# EAGLE design knife1 (EAGLE 7.7.0)
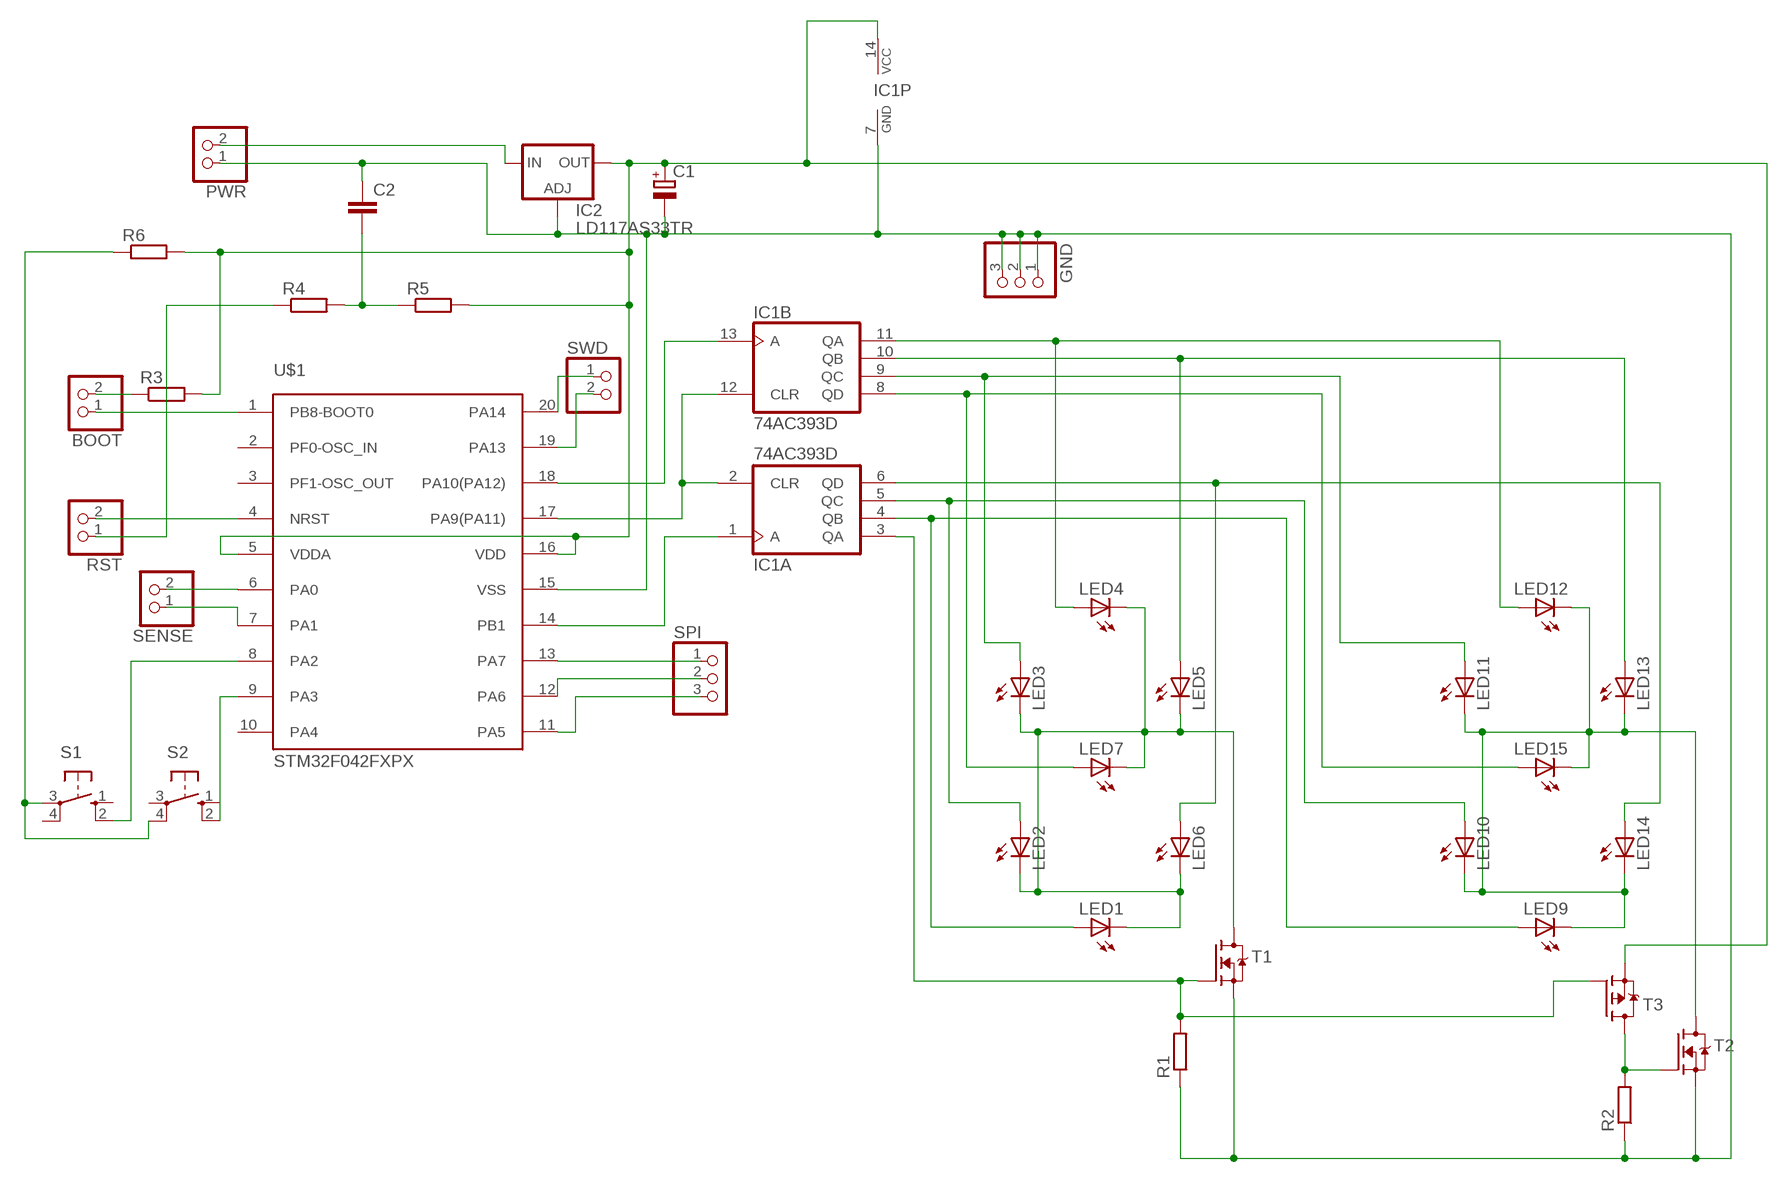
[diagram p0: schematic, sheet 1]

## Parts
BOOT  PINHD-1X2  [1X02]
C1  CPOL-EUSMCD  [SMC_D]
C2  C-EUC1206  [C1206]
GND  PINHD-1X3  [1X03]
IC1  74AC393D  [SO14]
IC2  LD117AS33TR  [SOT223]
LED1  LEDSQR2X5  [LED2X5]
LED2  LEDSQR2X5  [LED2X5]
LED3  LEDSQR2X5  [LED2X5]
LED4  LEDSQR2X5  [LED2X5]
LED5  LEDSQR2X5  [LED2X5]
LED6  LEDSQR2X5  [LED2X5]
LED7  LEDSQR2X5  [LED2X5]
LED9  LEDSQR2X5  [LED2X5]
LED10  LEDSQR2X5  [LED2X5]
LED11  LEDSQR2X5  [LED2X5]
LED12  LEDSQR2X5  [LED2X5]
LED13  LEDSQR2X5  [LED2X5]
LED14  LEDSQR2X5  [LED2X5]
LED15  LEDSQR2X5  [LED2X5]
PWR  PINHD-1X2  [1X02]
R1  R-EU_M1206  [M1206]
R2  R-EU_M1206  [M1206]
R3  R-EU_M1206  [M1206]
R4  R-EU_M1206  [M1206]
R5  R-EU_M1206  [M1206]
R6  R-EU_M1206  [M1206]
RST  PINHD-1X2  [1X02]
S1  10-XX  [B3F-10XX]
S2  10-XX  [B3F-10XX]
SENSE  PINHD-1X2  [1X02]
SPI  PINHD-1X3  [1X03]
SWD  PINHD-1X2  [1X02]
T1  MOSFET-N-SOT23  [SOT23]
T2  MOSFET-N-SOT23  [SOT23]
T3  MOSFET-P-SOT23  [SOT23]
U$1  STM32F042FXPX  [TSSOP20]

## Nets
N$1: LED1.K(C) LED2.K(C) LED3.K(C) LED4.K(C) LED5.K(C) LED6.K(C) LED7.K(C) T1.3(D)
N$2: R2.2 T2.1(G) T3.3(D)
N$3: IC1.4(A:QB) LED1.A LED9.A
N$4: LED9.K(C) LED10.K(C) LED11.K(C) LED12.K(C) LED13.K(C) LED14.K(C) LED15.K(C) T2.3(D)
N$5: C1.- C2.1 GND.1 GND.2 GND.3 IC1.7(P:GND) IC2.1(ADJ) PWR.1 R1.1 R2.1 T1.2(S) T2.2(S) U$1.15(VSS)
N$6: IC1.3(A:QA) R1.2 T1.1(G) T3.1(G)
N$7: IC1.5(A:QC) LED2.A LED10.A
N$8: IC2.3(IN) PWR.2
N$9: IC1.6(A:QD) LED6.A LED14.A
N$10: IC1.2(A:CLR) IC1.12(B:CLR) U$1.17(PA9(PA11))
N$11: IC1.8(B:QD) LED7.A LED15.A
N$12: SPI.1 U$1.13(PA7)
N$13: IC1.9(B:QC) LED3.A LED11.A
N$14: IC1.13(B:A) U$1.18(PA10(PA12))
N$15: IC1.10(B:QB) LED5.A LED13.A
N$16: SPI.2 U$1.12(PA6)
N$17: IC1.11(B:QA) LED4.A LED12.A
N$18: C1.+ IC1.14(P:VCC) IC2.4(OUT) R3.2 R5.2 R6.2 T3.2(S) U$1.5(VDDA) U$1.16(VDD)
N$19: SPI.3 U$1.11(PA5)
N$20: SENSE.2 U$1.6(PA0)
N$21: SENSE.1 U$1.7(PA1)
N$23: BOOT.1 U$1.1(PB8-BOOT0)
N$24: BOOT.2 R3.1
N$25: RST.2 U$1.4(NRST)
N$26: R4.1 RST.1
N$27: C2.2 R4.2 R5.1
N$28: R6.1 S1.3(P) S2.4(P1)
N$29: S1.2(S1) U$1.8(PA2)
N$30: S2.2(S1) U$1.9(PA3)
N$31: SWD.1 U$1.20(PA14)
N$32: SWD.2 U$1.19(PA13)
N$33: IC1.1(A:A) U$1.14(PB1)
Unconnected: S1.1(S) S1.4(P1) S2.1(S) S2.3(P) U$1.2(PF0-OSC_IN) U$1.3(PF1-OSC_OUT) U$1.10(PA4)

## Library data of the parts
BOOT PWR RST SENSE SWD = pinhead:PINHD-1X2: PIN HEADER
C1 = resistor:CPOL-EU: POLARIZED CAPACITOR, European symbol
C2 = resistor:C-EU: CAPACITOR, European symbol
GND SPI = pinhead:PINHD-1X3: PIN HEADER
IC1 = 74xx-eu:74*393: Dual 4-bit decade and binary COUNTER
IC2 = v-reg:LD117A?*: Low drop fixed and adjustable positive voltage regulators 1 A Source: http://www.st.com/stonline/products/literature/ds/7194/ld1117axx.pdf
LED1-LED7 LED9-LED15 = led:LED: LED OSRAM: - CHIPLED LG R971, LG N971, LY N971, LG Q971, LY Q971, LO R971, LY R971 LH N974, LH R974 LS Q976, LO Q976, LY Q976 LO Q996 - Hyper CHIPLED LW Q18S LB Q993, LB Q99A, LB R99A - SideLED LS A670, LO A670, LY A670, LG A670, LP A670 LB A673, LV A673, LT A673, LW A673 LH A674 LY A675 LS A676, LA A676, LO A676, LY A676, LW A676 LS A679, LY A679, LG A679 - Hyper Micro SIDELED® LS Y876, LA Y876, LO Y876, LY Y876 LT Y87S - SmartLED LW L88C, LW L88S LB L89C, LB L89S, LG L890 LS L89K, LO L89K, LY L89K LS L896, LA L896, LO L896, LY L896 - TOPLED LS T670, LO T670, LY T670, LG T670, LP T670 LSG T670, LSP T670, LSY T670, LOP T670, LYG T670 LG T671, LOG T671, LSG T671 LB T673, LV T673, LT T673, LW T673 LH T674 LS T676, LA T676, LO T676, LY T676, LB T676, LH T676, LSB T676, LW T676 LB T67C, LV T67C, LT T67C, LS T67K, LO T67K, LY T67K, LW E67C LS E67B, LA E67B, LO E67B, LY E67B, LB E67C, LV E67C, LT E67C LW T67C LS T679, LY T679, LG T679 LS T770, LO T770, LY T770, LG T770, LP T770 LB T773, LV T773, LT T773, LW T773 LH T774 LS E675, LA E675, LY E675, LS T675 LS T776, LA T776, LO T776, LY T776, LB T776 LHGB T686 LT T68C, LB T68C - Hyper Mini TOPLED® LB M676 - Mini TOPLED Santana® LG M470 LS M47K, LO M47K, LY M47K Source: http://www.osram.convergy.de LUXEON: - LUMILED® LXK2-PW12-R00, LXK2-PW12-S00, LXK2-PW14-U00, LXK2-PW14-V00 LXK2-PM12-R00, LXK2-PM12-S00, LXK2-PM14-U00 LXK2-PE12-Q00, LXK2-PE12-R00, LXK2-PE12-S00, LXK2-PE14-T00, LXK2-PE14-U00 LXK2-PB12-K00, LXK2-PB12-L00, LXK2-PB12-M00, LXK2-PB14-N00, LXK2-PB14-P00, LXK2-PB14-Q00 LXK2-PR12-L00, LXK2-PR12-M00, LXK2-PR14-Q00, LXK2-PR14-R00 LXK2-PD12-Q00, LXK2-PD12-R00, LXK2-PD12-S00 LXK2-PH12-R00, LXK2-PH12-S00 LXK2-PL12-P00, LXK2-PL12-Q00, LXK2-PL12-R00 Source: www.luxeon.com KINGBRIGHT: KA-3528ASYC Source: www.kingbright.com
R1-R6 = rcl:R-EU_: RESISTOR, European symbol
S1 S2 = switch-omron:10-XX: OMRON SWITCH; MPN: B3F-1000; OC_FARNELL: 176432; OC_NEWARK: 36M3542
T1 T2 = we-transistor:MOSFET-N: N-Channel MOSFET SOT23 N-Chn MOSFET TSM3404, IRLML2502 (Vgs>=+/-20V, Vds<=20V, Id>=3A + Rds<=0.05Ohm @ Vgs=4.5V) BSS138 (Vgs>=+/-20V, Vds<=40V, Id>=0.2A + Rds<=3Ohm @ Vgs=4.5V) SOT223 Low Side Switch with Protection (Infineon) BSP76 (Vin=0...10V, Vds<=42V, Id=1.4A + Rds=0.2Ohm @ Vin=5V) BSP77 (Vin=0...10V, Vds<=42V, Id=2.2A + Rds=0.1Ohm @ Vin=5V) D²Pak Low Side Switch with Protection (Infineon) BTS117TC (Vin=0...10V, Vds<=60V, Id=3.5A + Rds=0.12Ohm @ Vin=5V) BTS133TC (Vin=0...10V, Vds<=60V, Id=7A + Rds=0.06Ohm @ Vin=5V) BTS141TC (Vin=0...10V, Vds<=60V, Id=12A + Rds=0.03Ohm @ Vin=5V) BTS3018TC (Vin=0...10V, Vds<=60V, Id=6A + Rds=0.02Ohm @ Vin=5V)
T3 = we-transistor:MOSFET-P: P-Channel MOSFET SOT23 P-Chn MOSFET TSM3401, IRLML6402 (Vds>=20V, Id>=2A + Rds<=0.1Ohm @ Vgs=4.5V)
U$1 = stm32f0:STM32F042FXPX

## Board
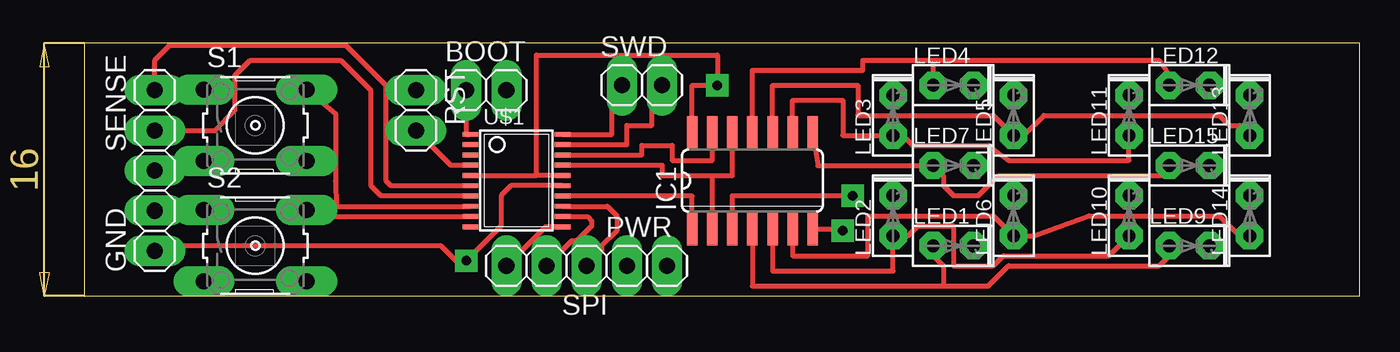
[diagram p1: board, top side]
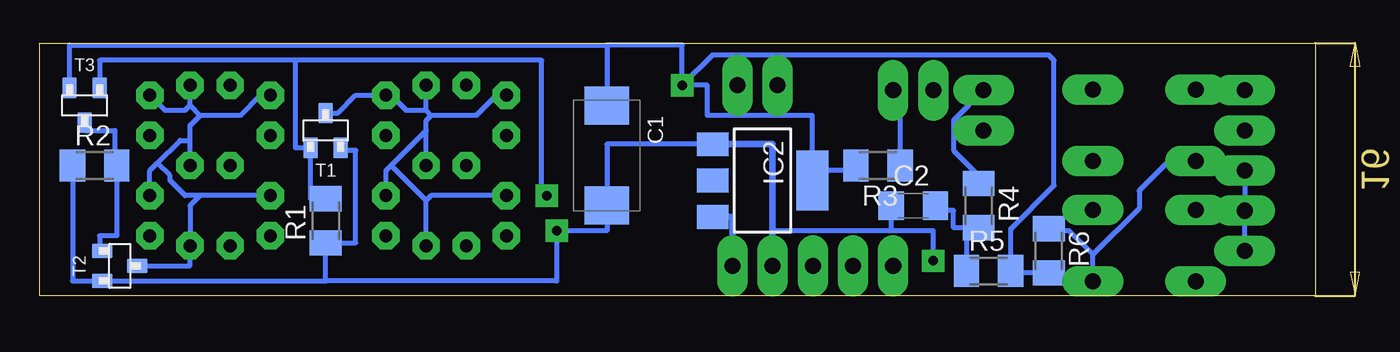
[diagram p2: board, bottom side, seen from below]

Size 80.64 x 16 mm. Coordinates in mm from the lower left corner, seen from the top.
Outline: 0,0 80.64,0 80.64,16 0,16 0,0
Copper layers (1*16): Top 0.035mm / dielectric 1.5mm / Bottom 0.035mm
Design rules "default *": minimum track width 10mil, minimum drill 24mil, track to track 8mil, track to pad 8mil, pad to pad 8mil, via to via 8mil, smd to smd 8mil, copper to edge 40mil, drill to drill 8mil, minimum pad ring 18mil, minimum via ring 16mil, stop-mask expansion 4mil, vias tented up to drill 0mil, thermal gap 10mil

### Footprints (pad centres in the part's own frame; a part is rotated, then mirrored left to right if it is on the bottom)
1X02 = drill 1.016 long: 1 -1.27,0; 2 1.27,0
SMC_D = smd 2.4 x 2.8: + -3.15,0; - 3.15,0
C1206 = smd 1.6 x 1.8: 1 -1.4,0; 2 1.4,0
1X03 = drill 1.016 long: 1 -2.54,0; 2 0,0; 3 2.54,0
SO14 = smd 0.66 x 2.032: 1 -3.81,-3.073; 2 -2.54,-3.073; 3 -1.27,-3.073; 4 0,-3.073; 5 1.27,-3.073; 6 2.54,-3.073; 7 3.81,-3.073; 8 3.81,3.073; 9 2.54,3.073; 10 1.27,3.073; 11 0,3.073; 12 -1.27,3.073; 13 -2.54,3.073; 14 -3.81,3.073
SOT223 = smd 1.5 x 2: 1 -2.3,-3.15; 2 0,-3.15; 3 2.3,-3.15 | smd 3.8 x 2: 4 0,3.15
LED2X5 = drill 0.813 octagon: A -1.27,0; K 1.27,0
M1206 = smd 1.6 x 2: 1 -1.4,0; 2 1.4,0
B3F-10XX = drill 1.016 long: 1 -3.251,2.261; 2 3.251,2.261; 3 -3.251,-2.261; 4 3.251,-2.261
SOT23 = smd 1.3 x 0.9: 1 -1.1,0.95; 2 -1.1,-0.95; 3 1.1,0
TSSOP20 = smd 0.305 x 0.991: 1 -2.925,-2.918; 2 -2.275,-2.918; 3 -1.625,-2.918; 4 -0.975,-2.918; 5 -0.325,-2.918; 6 0.325,-2.918; 7 0.975,-2.918; 8 1.625,-2.918; 9 2.275,-2.918; 10 2.925,-2.918; 11 2.925,2.918; 12 2.275,2.918; 13 1.625,2.918; 14 0.975,2.918; 15 0.325,2.918; 16 -0.325,2.918; 17 -0.975,2.918; 18 -1.625,2.918; 19 -2.275,2.918; 20 -2.925,2.918

### Placement (x,y rotation side)
BOOT  25.4,13.02 0 top
C1  44.77,8.89 270 bottom
C2  25.4,5.71 0 bottom
GND  4.45,5.4 90 top
IC1  42.23,7.3 0 top
IC2  34.92,7.3 270 bottom
LED1  54.93,3.17 0 top
LED2  51.12,5.08 90 top
LED3  51.12,11.43 90 top
LED4  54.93,13.34 0 top
LED5  58.74,11.43 90 top
LED6  58.74,5.08 90 top
LED7  54.93,8.26 0 top
LED9  69.85,3.17 0 top
LED10  66.04,5.08 90 top
LED11  66.04,11.43 90 top
LED12  69.85,13.34 0 top
LED13  73.66,11.43 90 top
LED14  73.66,5.08 90 top
LED15  69.85,8.26 0 top
PWR  35.56,1.91 0 top
R1  62.55,4.76 90 bottom
R2  77.15,8.26 0 bottom
R3  27.62,8.26 180 bottom
R4  21.27,5.71 270 bottom
R5  20.64,1.59 0 bottom
R6  16.83,2.86 270 bottom
RST  20.95,11.75 270 top
S1  10.79,10.79 0 top
S2  10.79,3.17 0 top
SENSE  4.45,11.75 90 top
SPI  29.21,1.91 180 top
SWD  35.24,13.34 0 top
T1  62.55,10.48 90 bottom
T2  75.56,1.91 0 bottom
T3  77.79,12.06 270 bottom
U$1  27.3,7.3 270 top

### Tracks (layer width: path | path; a pad name or v marks a point on that pad's centre or on a via)
N$1
  Bottom 0.305: LED3.K 51.75,12.7 53.02,11.43 55.88,11.43 | 55.88,11.43 56.2,11.75 | 56.2,11.75 LED4.K | 56.2,11.75 57.47,11.75 58.42,12.7 LED5.K 60.64,12.7 61.77,11.58 T1.3 | LED7.K 56.2,10.48 | 56.2,10.48 56.2,11.11 55.88,11.43 | LED6.K 58.74,7.94 58.42,8.26 | 58.42,8.26 56.2,10.48 | LED1.K 56.2,6.03 | 56.2,6.03 58.42,8.26 | LED2.K 55.88,6.35 56.2,6.03
N$2
  Bottom 0.305: T2.1 76.83,3.17 76.83,3.81 75.75,3.81 R2.2 75.88,8.26 75.88,10.48 77.79,10.48 T3.3
N$3
  Top 0.305: LED1.A 53.66,2.54 54.29,1.91 54.29,0.64 | LED9.A 68.58,2.54 67.94,1.91 58.42,1.91 57.15,0.64 54.29,0.64 | IC1.4 42.23,0.64 54.29,0.64
N$4
  Bottom 0.305: LED11.K 66.67,12.7 67.94,11.43 70.48,11.43 | 70.48,11.43 71.12,12.06 | 71.12,12.06 LED12.K | LED13.K 72.71,11.75 71.44,11.75 71.12,12.06 | LED15.K 71.12,9.84 | 71.12,9.84 71.12,10.79 70.48,11.43 | LED10.K 70.48,6.35 | 70.48,6.35 71.12,5.71 LED9.K 71.12,1.91 T2.3 | LED14.K 73.66,7.94 73.18,8.41 | 73.18,8.41 71.75,9.84 71.12,9.84 | 70.48,6.35 71.44,6.35 72.39,7.3 72.39,7.62 73.18,8.41
N$5  (via drill 0.6)
  Top 0.305: IC1.7 48.16,4.23 v47.94,4.13 | U$1.15 26.98,6.98 26.35,6.35 26.35,4.45 v24.13,2.22 23.5,2.22 22.54,3.17 4.45,3.17 GND.1
  Bottom 0.305: R2.1 78.55,0.95 T2.2 62.55,0.95 | T1.2 61.6,9.21 60.64,9.21 60.64,3.36 R1.1 62.55,0.95 | 62.55,0.95 47.94,0.95 v47.94,4.13 44.77,4.13 C1.- 44.77,9.6 IC2.1 | v24.13,2.22 24.13,4.13 26.8,4.13 | 26.8,4.13 34.29,4.13 | C2.1 26.8,4.13 | GND.3 GND.2 GND.1
  Bottom 0.406: PWR.1 34.29,4.13 34.29,9.6 IC2.1
N$6  (via drill 0.6)
  Top 0.305: IC1.3 40.96,6.35 v48.58,6.35
  Bottom 0.305: R1.2 63.5,6.16 T1.1 64.45,9.38 64.45,14.92 | 64.45,14.92 76.84,14.92 T3.1 | 64.45,14.92 48.9,14.92 48.9,6.67 arc-90 v48.58,6.35
N$7
  Top 0.305: LED10.A 64.77,2.54 58.1,2.54 57.47,1.91 54.93,1.91 54.93,4.45 52.7,4.45 52.07,3.81 LED2.A 51.12,1.59 43.5,1.59 IC1.5
N$8
  Bottom 0.406: PWR.2 36.83,5 IC2.3
N$9
  Top 0.305: LED14.A 73.03,3.81 71.75,5.08 63.5,5.08 60.01,3.81 LED6.A 57.47,5.08 49.53,5.08 49.53,2.54 44.77,2.54 IC1.6
N$10
  Top 0.305: U$1.17 36.51,8.28 36.51,7.62 39.69,7.62 | 39.69,7.62 40.96,7.62 IC1.12 | IC1.2 39.69,7.62
N$11
  Top 0.305: LED15.A 68.58,7.62 57.78,7.62 56.52,6.35 54.93,6.35 54.29,6.99 54.29,7.62 LED7.A 46.35,8.26 IC1.8
N$12
  Top 0.305: U$1.13 33.06,5.68 33.66,5.08 33.66,4.13 32.7,3.17 32.7,2.86 SPI.1
N$13
  Top 0.305: LED11.A 66.04,8.57 58.42,8.57 57.15,9.53 52.39,9.53 51.75,10.16 LED3.A 47.94,10.16 47.94,12.38 44.77,12.38 IC1.9
N$14
  Top 0.305: U$1.18 35.24,8.93 35.24,9.53 37.15,9.53 37.15,8.57 39.69,8.57 IC1.13
N$15
  Top 0.305: LED13.A 73.03,10.79 72.39,10.79 71.75,11.43 60.64,11.43 59.37,10.16 LED5.A 57.47,11.43 48.9,11.43 48.9,13.34 43.5,13.34 IC1.10
N$16
  Top 0.305: U$1.12 31.8,5.03 32.07,4.76 32.07,4.45 31.11,3.49 30.8,3.49 SPI.2
N$17
  Top 0.305: LED4.A 53.66,14.92 | 53.66,14.92 67.94,14.92 68.58,13.97 LED12.A | IC1.11 42.23,14.29 49.21,14.29 49.21,14.92 53.66,14.92
N$18  (via drill 0.6)
  Top 0.305: U$1.5 28.57,7.63 | IC1.14 38.42,13.34 v40.01,13.34 40.01,15.24 28.57,15.24 28.57,7.63 | U$1.16 28.57,7.63
  Bottom 0.305: T3.2 78.74,15.88 44.77,15.88 | 44.77,15.88 C1.+ | v40.01,13.34 40.01,15.88 44.77,15.88 | IC2.4 31.77,7.94 | 31.77,7.94 31.77,11.43 38.42,11.43 38.42,13.34 v40.01,13.34 | R3.2 29.02,7.94 31.77,7.94 | R6.2 19.11,1.46 R5.2 19.24,4.26 16.51,6.99 16.51,14.92 16.83,15.24 38.1,15.24 v40.01,13.34
N$19
  Top 0.305: U$1.11 29.14,4.38 SPI.3
N$20
  Top 0.305: SENSE.2 4.45,14.92 5.4,15.88 16.51,15.88 19.05,13.34 19.05,7.3 19.37,6.99 U$1.6
N$21
  Top 0.305: SENSE.1 8.26,10.48 9.53,11.75 9.53,13.97 10.48,14.92 16.19,14.92 18.1,13.02 18.1,6.99 18.73,6.35 24.36,6.35 U$1.7
N$23
  Top 0.305: BOOT.1 24.13,10.23 U$1.1
N$24
  Bottom 0.305: R3.1 26.22,13.02 BOOT.2
N$25
  Top 0.305: RST.2 23.16,8.28 U$1.4
N$26
  Bottom 0.305: RST.1 22.86,11.11 22.86,9.21 21.27,7.62 R4.1
N$27
  Bottom 0.305: C2.2 24,5.4 22.86,5.4 22.86,4.32 R4.2 22.04,3.55 R5.1
N$28
  Bottom 0.305: S2.4 14.05,2.62 | 14.05,2.62 15.56,4.13 16.7,4.13 R6.1 | S1.3 9.25,8.53 11.11,6.67 11.11,5.55 14.05,2.62
N$29
  Top 0.305: S1.2 15.88,11.54 15.88,7.3 15.91,5.68 U$1.8
N$30
  Top 0.305: S2.2 14.45,5.03 U$1.9
N$31
  Top 0.305: U$1.20 33.34,10.23 33.34,12.7 SWD.1
N$32
  Top 0.305: U$1.19 34.29,9.58 34.29,10.79 35.88,10.79 35.88,12.7 SWD.2
N$33
  Top 0.305: IC1.1 38.42,6.33 U$1.14